# EAGLE design DMClock2018 (EAGLE 5.12)
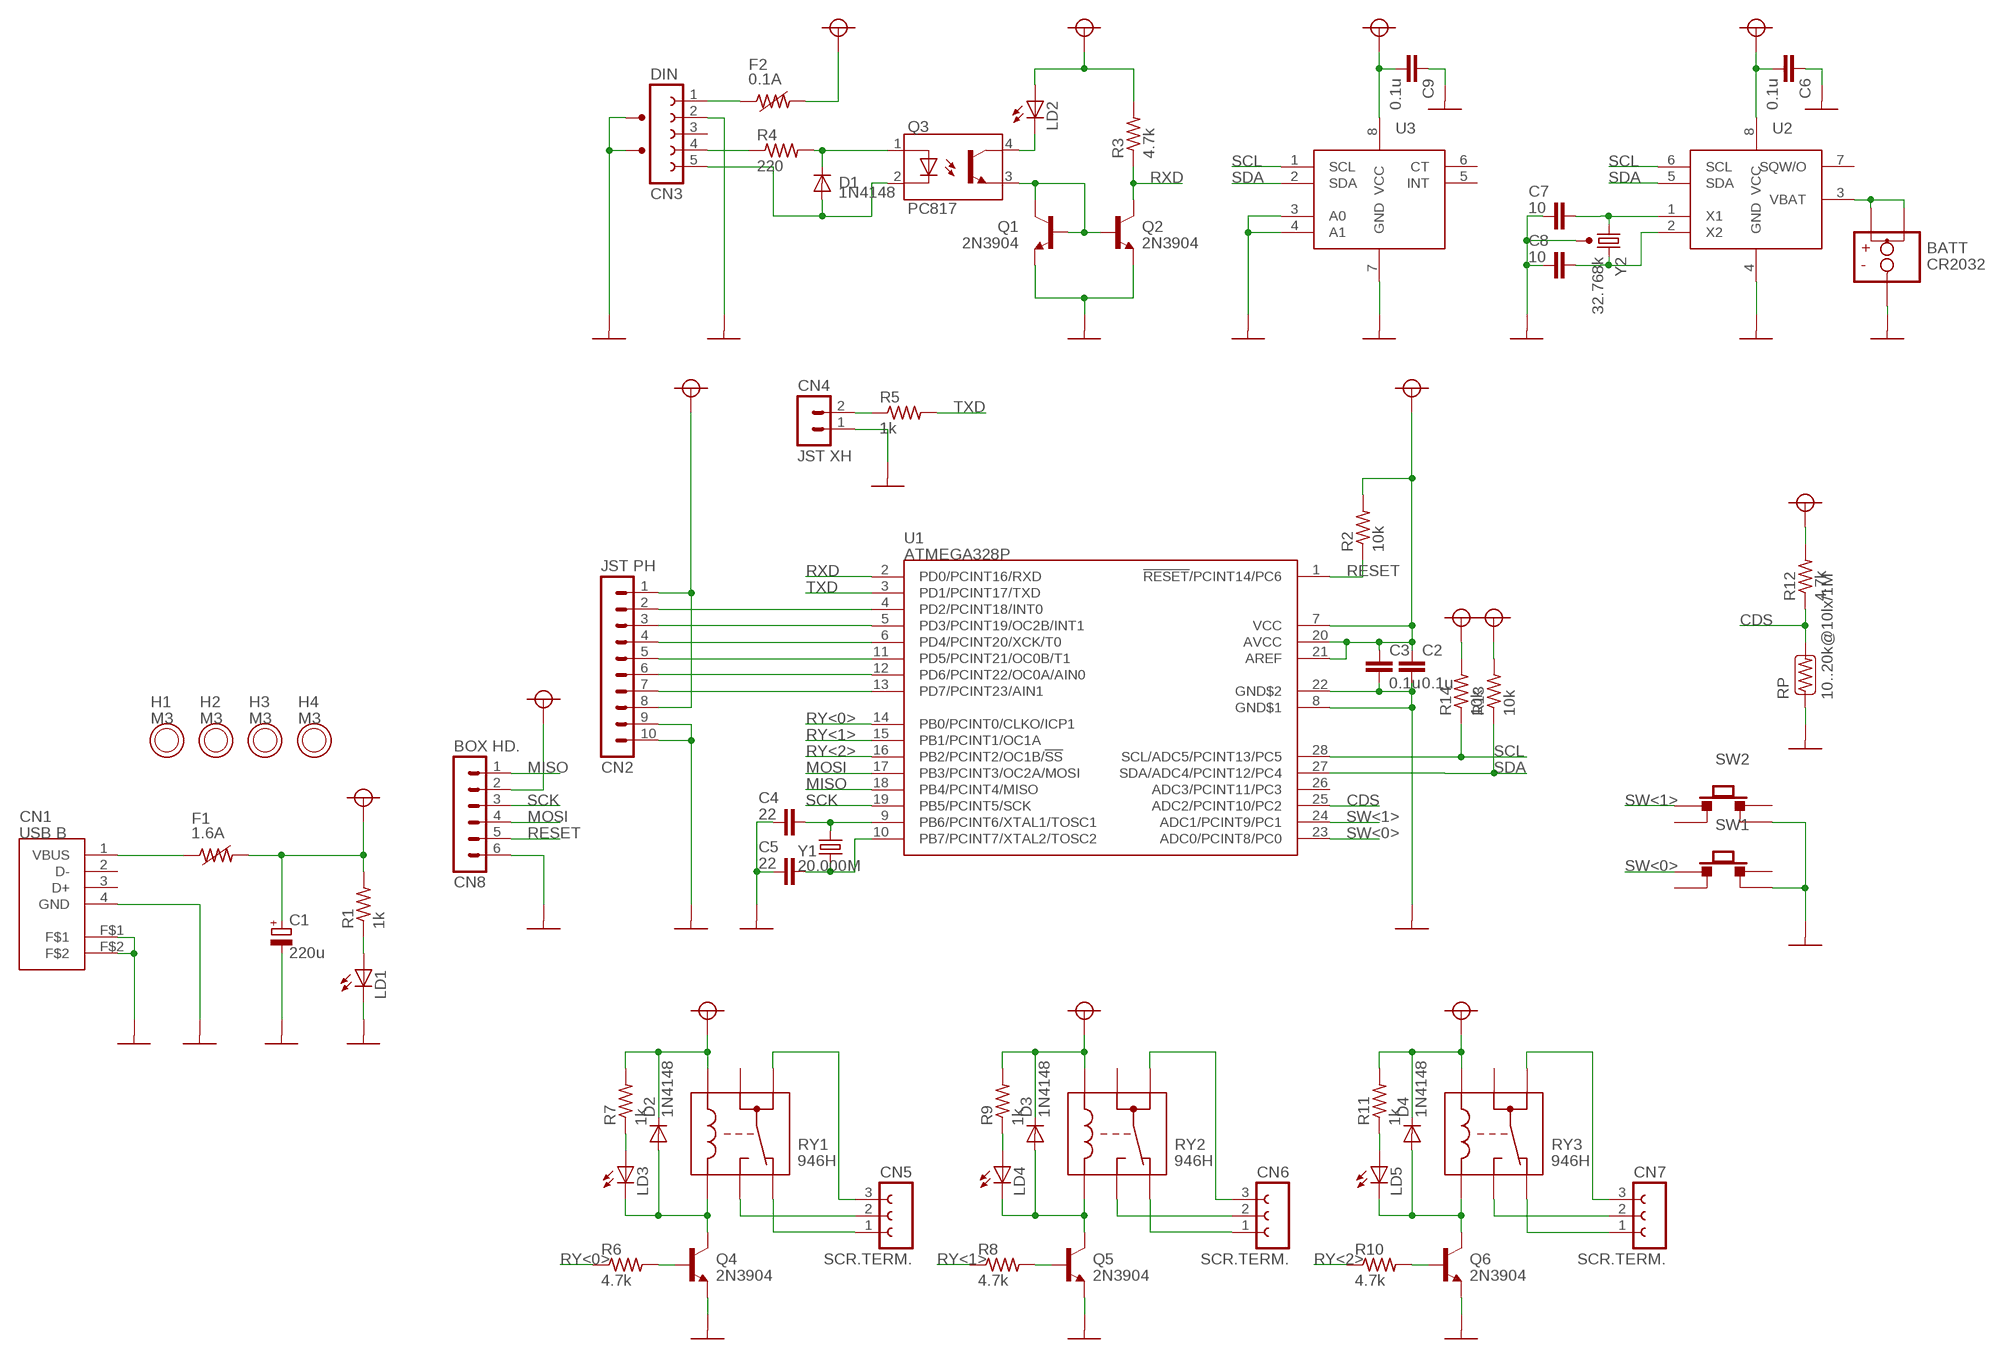
[diagram p0: schematic, sheet 1]

## Parts
BATT  CR2032  BATT_2+'CH005-2032'  [CH005-2032]
C1  220u  CPOL'8MM_3MM5'  [CPOL_8MM_3MM5]
C2  0.1u  C'100MIL'  [C_100MIL]
C3  0.1u  C'100MIL'  [C_100MIL]
C4  22  C'100MIL'  [C_100MIL]
C5  22  C'100MIL'  [C_100MIL]
C6  0.1u  C'100MIL'  [C_100MIL]
C7  10  C'100MIL'  [C_100MIL]
C8  10  C'100MIL'  [C_100MIL]
C9  0.1u  C'100MIL'  [C_100MIL]
CN1  USB B  USBB_F2'5075BR-04'  [5075BR-04]
CN2  JST PH  MA10'PH'  [PH10]
CN3  DIN  DIN05_F2'KDJ03'  [KDJ03-5]
CN4  JST XH  MA02'XH'  [XH02]
CN5  SCR.TERM.  SCRTERM03'TB112'  [TB112_03]
CN6  SCR.TERM.  SCRTERM03'TB112'  [TB112_03]
CN7  SCR.TERM.  SCRTERM03'TB112'  [TB112_03]
CN8  BOX HD.  MA06-2'BOX'  [MA06-2_BOX]
D1  1N4148  D'200MIL'  [D_200MIL]
D2  1N4148  D'200MIL'  [D_200MIL]
D3  1N4148  D'200MIL'  [D_200MIL]
D4  1N4148  D'200MIL'  [D_200MIL]
F1  1.6A  PF'7MM4X3MM'  [PF_7MM4X3MM]
F2  0.1A  PF'7MM4X3MM'  [PF_7MM4X3MM]
H1  M3  H'M3'  [H_M3]
H2  M3  H'M3'  [H_M3]
H3  M3  H'M3'  [H_M3]
H4  M3  H'M3'  [H_M3]
LD1  LD'3MM'  [LD_3MM]
LD2  LD'3MM'  [LD_3MM]
LD3  LD'3MM'  [LD_3MM]
LD4  LD'3MM'  [LD_3MM]
LD5  LD'3MM'  [LD_3MM]
Q1  2N3904  NPN'TO92_EBC'  [TO92]
Q2  2N3904  NPN'TO92_EBC'  [TO92]
Q3  PC817  PHI'DIL04_AKEC'  [DIL04]
Q4  2N3904  NPN'TO92_EBC'  [TO92]
Q5  2N3904  NPN'TO92_EBC'  [TO92]
Q6  2N3904  NPN'TO92_EBC'  [TO92]
R1  1k  R'300MIL'  [R_300MIL]
R2  10k  R'300MIL'  [R_300MIL]
R3  4.7k  R'300MIL'  [R_300MIL]
R4  220  R'300MIL'  [R_300MIL]
R5  1k  R'300MIL'  [R_300MIL]
R6  4.7k  R'300MIL'  [R_300MIL]
R7  1k  R'300MIL'  [R_300MIL]
R8  4.7k  R'300MIL'  [R_300MIL]
R9  1k  R'300MIL'  [R_300MIL]
R10  4.7k  R'300MIL'  [R_300MIL]
R11  1k  R'300MIL'  [R_300MIL]
R12  4.7k  R'300MIL'  [R_300MIL]
R13  10k  R'300MIL'  [R_300MIL]
R14  10k  R'300MIL'  [R_300MIL]
RP  10..20k@10lx/1M  RP'MI5'  [RP_MI5]
RY1  946H  RY_1CC'946H'  [946H_1C]
RY2  946H  RY_1CC'946H'  [946H_1C]
RY3  946H  RY_1CC'946H'  [946H_1C]
SW1  PUSHSW_1PP1TT'*'  [PUSHSW_*]
SW2  PUSHSW_1PP1TT'*'  [PUSHSW_*]
U1  ATMEGA328P  ATMEGA8_DIL  [DIL28]
U2  DS1307'DIL'  [DIL08]
U3  ADT7410'SO'  [SO08]
Y1  20.000M  Y'HC49'  [HC49]
Y2  32.768k  Y_FRAME'VT200'  [VT200]

## Nets
+5V0: C1.+ C2.1 C3.1 C6.2 C9.2 CN2.1 CN2.8 CN8.2 D2.K D3.K D4.K F1.2 F2.2 LD2.A R1.2 R2.2 R3.2 R7.2 R9.2 R11.2 R12.2 R13.2 R14.2 RY1.COIL$2 RY2.COIL$2 RY3.COIL$2 U1.7(VCC) U1.20(AVCC) U1.21(AREF) U2.8(VCC) U3.8(VCC) ; supply symbol labelled V+
CDS: R12.1 RP.2 U1.25(ADC2/PCINT10/PC2)
GND: BATT.- C1.- C2.2 C3.2 C4.1 C5.1 C6.1 C7.1 C8.1 C9.1 CN1.4(GND) CN1.F$1 CN1.F$2 CN2.9 CN2.10 CN3.2 CN3.F1 CN3.F2 CN4.1 CN8.6 LD1.K Q1.1(E) Q2.1(E) Q4.1(E) Q5.1(E) Q6.1(E) RP.1 SW1.P1$2 SW2.P1$2 U1.8(GND$1) U1.22(GND$2) U2.4(GND) U3.3(A0) U3.4(A1) U3.7(GND) Y2.F
MISO: CN8.1 U1.18(PB4/PCINT4/MISO)
MOSI: CN8.4 U1.17(PB3/PCINT3/OC2A/MOSI)
N$1: CN2.2 U1.4(PD2/PCINT18/INT0)
N$2: CN1.1(VBUS) F1.1
N$3: LD1.A R1.1
N$4: CN2.3 U1.5(PD3/PCINT19/OC2B/INT1)
N$5: CN2.4 U1.6(PD4/PCINT20/XCK/T0)
N$6: CN2.5 U1.11(PD5/PCINT21/OC0B/T1)
N$7: CN2.6 U1.12(PD6/PCINT22/OC0A/AIN0)
N$8: CN2.7 U1.13(PD7/PCINT23/AIN1)
N$9: CN3.4 R4.1
N$10: LD2.K Q3.4(C)
N$11: Q1.2(B) Q1.3(C) Q2.2(B) Q3.3(E)
N$12: D1.K Q3.1(A) R4.2
N$13: CN4.2 R5.1
N$14: BATT.+$1 BATT.+$2 U2.3(VBAT)
N$15: C5.2 U1.10(PB7/PCINT7/XTAL2/TOSC2) Y1.1
N$16: C4.2 U1.9(PB6/PCINT6/XTAL1/TOSC1) Y1.2
N$17: Q4.2(B) R6.2
N$18: CN3.1 F2.1
N$19: CN3.5 D1.A Q3.2(K)
N$21: D2.A LD3.K Q4.3(C) RY1.COIL$1
N$23: LD3.A R7.1
N$24: CN5.3 RY1.COM$2
N$25: CN5.2 RY1.NO
N$26: CN5.1 RY1.NC
N$27: Q5.2(B) R8.2
N$28: D3.A LD4.K Q5.3(C) RY2.COIL$1
N$29: LD4.A R9.1
N$30: CN6.3 RY2.COM$2
N$31: CN6.2 RY2.NO
N$32: CN6.1 RY2.NC
N$34: Q6.2(B) R10.2
N$35: D4.A LD5.K Q6.3(C) RY3.COIL$1
N$36: LD5.A R11.1
N$37: CN7.3 RY3.COM$2
N$38: CN7.2 RY3.NO
N$39: CN7.1 RY3.NC
N$41: C7.2 U2.1(X1) Y2.1
N$42: C8.2 U2.2(X2) Y2.2
RESET: CN8.5 R2.1 U1.1(!RESET!/PCINT14/PC6)
RXD: Q2.3(C) R3.1 U1.2(PD0/PCINT16/RXD)
RY<0>: R6.1 U1.14(PB0/PCINT0/CLKO/ICP1)
RY<1>: R8.1 U1.15(PB1/PCINT1/OC1A)
RY<2>: R10.1 U1.16(PB2/PCINT2/OC1B/!SS!)
SCK: CN8.3 U1.19(PB5/PCINT5/SCK)
SCL: R14.1 U1.28(SCL/ADC5/PCINT13/PC5) U2.6(SCL) U3.1(SCL)
SDA: R13.1 U1.27(SDA/ADC4/PCINT12/PC4) U2.5(SDA) U3.2(SDA)
SW<0>: SW1.P2$1 U1.23(ADC0/PCINT8/PC0)
SW<1>: SW2.P2$1 U1.24(ADC1/PCINT9/PC1)
TXD: R5.2 U1.3(PD1/PCINT17/TXD)
Unconnected: CN1.2(D-) CN1.3(D+) CN3.3 RY1.COM$1 RY2.COM$1 RY3.COM$1 SW1.P1$1 SW1.P2$2 SW2.P1$1 SW2.P2$2 U1.26(ADC3/PCINT11/PC3) U2.7(SQW/O) U3.5(INT) U3.6(CT)

## Library data of the parts
BATT = DMClock2018:BATT_2+: Battery connector, with 2 positive pads
C1 = DMClock2018:CPOL: Capacitor, polarized
C2-C9 = DMClock2018:C: Capacitor, non-polarized
CN1 = DMClock2018:USBB_F2: USB type B connector, with 2 frame poles
CN2 = DMClock2018:MA10: Male header, 10 poles
CN3 = DMClock2018:DIN05_F2: DIN connector, 5 poles, with 2 frame poles
CN4 = DMClock2018:MA02: Male header, 2 poles
CN5-CN7 = DMClock2018:SCRTERM03: Screw terminal, 3 poles
CN8 = DMClock2018:MA06-2: Male header, 6 poles
D1-D4 = DMClock2018:D: Diode
F1 F2 = DMClock2018:PF: Polyfuse
H1-H4 = DMClock2018:H: Unmasked PCB hole
LD1-LD5 = DMClock2018:LD: Light-emitting diode
Q1 Q2 Q4-Q6 = DMClock2018:NPN: NPN bipolar junction transistor
Q3 = DMClock2018:PHI: Photo isolator, transitor output
R1-R14 = DMClock2018:R: Resistor
RP = DMClock2018:RP: Photo resistor
RY1-RY3 = DMClock2018:RY_1CC: Magnetic relay, type 1C with two common contacts
SW1 SW2 = DMClock2018:PUSHSW_1PP1TT: Push switch, 1 pole, 1 throw, with 2 pads each
U1 = DMClock2018:ATMEGA8_DIL: Atmel ATmega__8 AVR 8-bit microcontroller (DIL package)
U2 = DMClock2018:DS1307: Maxim DS1307 real time clock
U3 = DMClock2018:ADT7410: Analog Devices I2C temperature sensor
Y1 = DMClock2018:Y: Crystal oscillator
Y2 = DMClock2018:Y_FRAME: Crystal oscillator, with a frame pad

## Board
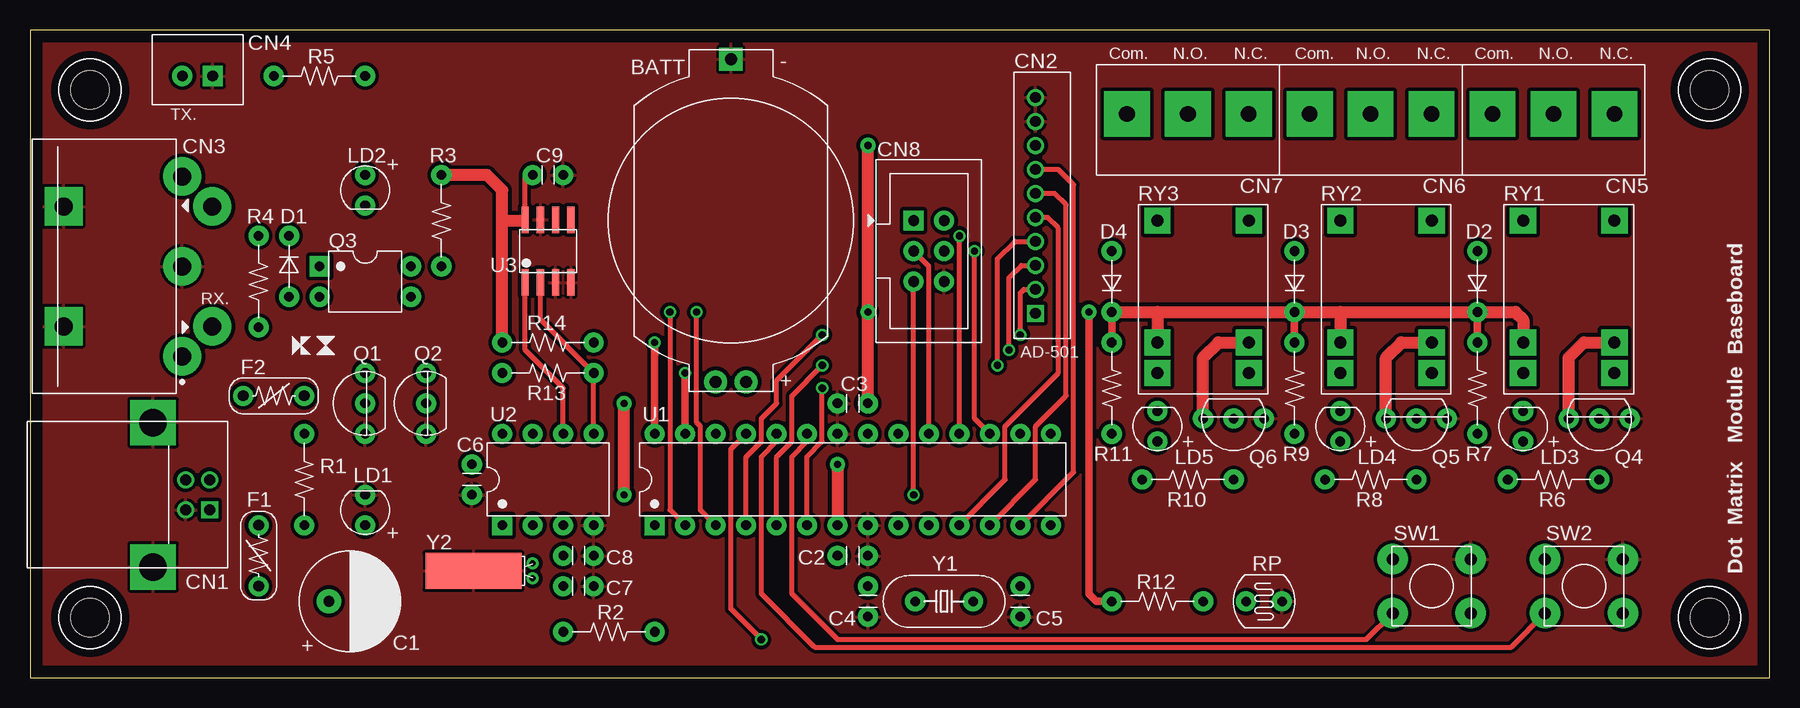
[diagram p1: board, top side]
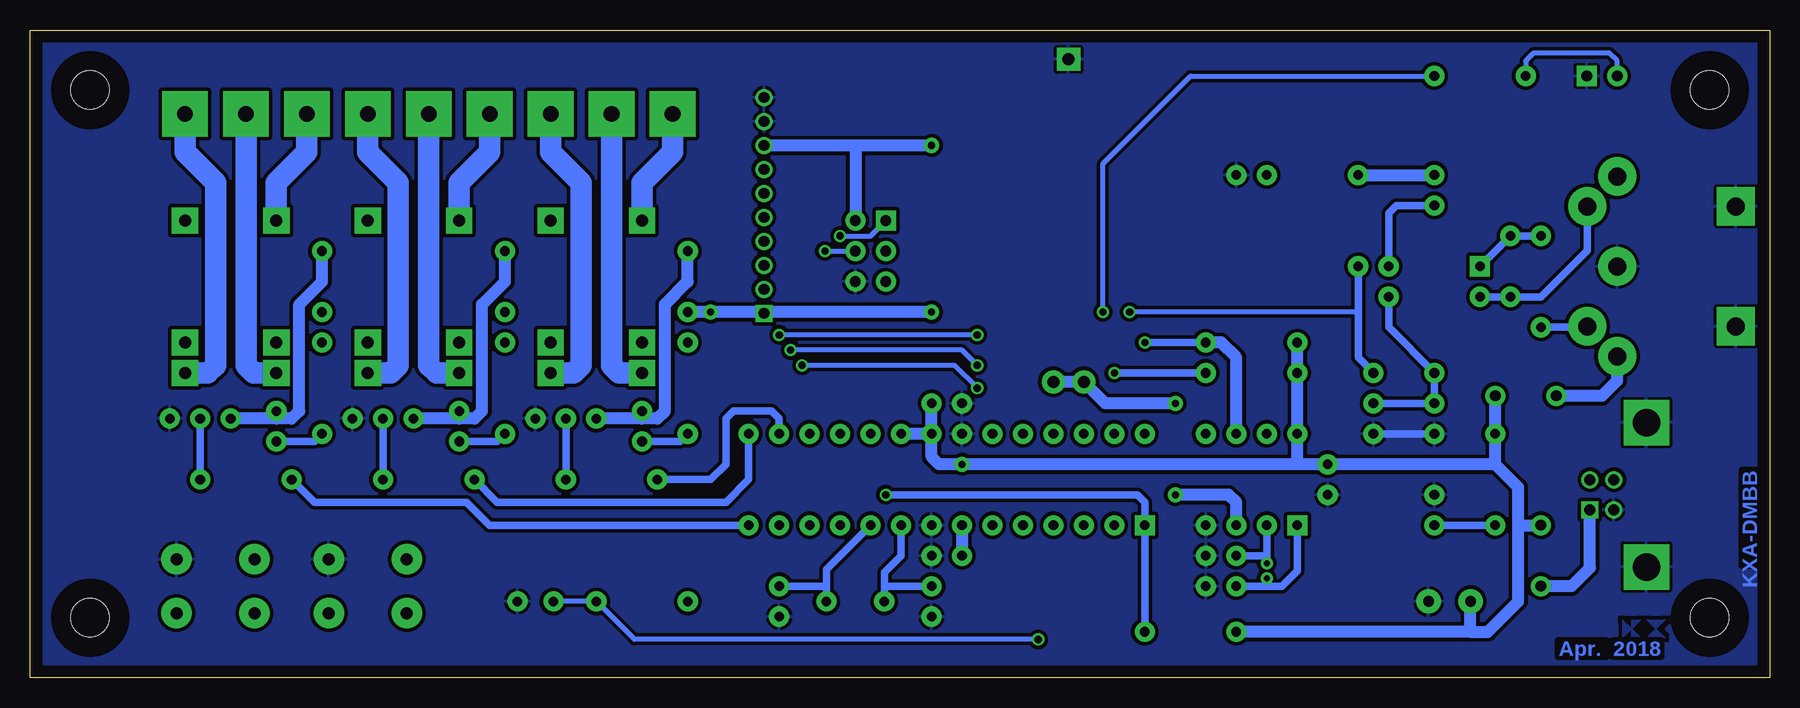
[diagram p2: board, bottom side, seen from below]

Size 145 x 54 mm. Coordinates in mm from the lower left corner, seen from the top.
Outline: 0,0 145,0 145,54 0,54 0,0
Copper layers (1*16): Top 0.035mm / dielectric 1.5mm / Bottom 0.035mm
Design rules "default *": minimum track width 10mil, minimum drill 24mil, track to track 12mil, track to pad 12mil, pad to pad 12mil, via to via 12mil, smd to smd 12mil, copper to edge 40mil, drill to drill 8mil, minimum pad ring 10mil, minimum via ring 8mil, stop-mask expansion 4mil, vias tented up to drill 0mil, thermal gap 10mil

### Footprints (pad centres in the part's own frame; a part is rotated, then mirrored left to right if it is on the bottom)
CH005-2032 = drill 1 pad 1.93 round: +$1 -13.45,-1.27; +$2 -13.45,1.27 | drill 1 pad 1.93 square: - 13.45,0
CPOL_8MM_3MM5 = drill 0.9 pad 2.032 round: + -1.75,0; - 1.75,0
C_100MIL = drill 0.8 pad 1.676 round: 1 -1.27,0; 2 1.27,0
5075BR-04 = drill 0.9 pad 1.422 square: 1 -1.25,-1 | drill 0.9 pad 1.422 round: 2 1.25,-1; 3 1.25,1; 4 -1.25,1 | drill 2.3 pad 3.81 square: F$1 -6.02,3.71; F$2 6.02,3.71
PH10 = drill 0.9 pad 1.422 square: 1 -9,0 | drill 0.9 pad 1.422 round: 2 -7,0; 3 -5,0; 4 -3,0; 5 -1,0; 6 1,0; 7 3,0; 8 5,0; 9 7,0; 10 9,0
KDJ03-5 = drill 1.5 pad 3.175 round: 1 -7.5,0; 2 0,0; 3 7.5,0; 4 -5,-2.5; 5 5,-2.5 | drill 1.5 pad 3.175 square: F1 -5,9.9; F2 5,9.9
XH02 = drill 0.9 pad 1.676 square: 1 -1.27,0 | drill 0.9 pad 1.676 round: 2 1.27,0
TB112_03 = drill 1.3 pad 3.81 square: 1 -5.08,0; 2 0,0; 3 5.08,0
MA06-2_BOX = drill 0.9 pad 1.676 square: 1 -1.27,2.54 | drill 0.9 pad 1.676 round: 2 1.27,2.54; 3 -1.27,0; 4 1.27,0; 5 -1.27,-2.54; 6 1.27,-2.54
D_200MIL = drill 0.8 pad 1.676 round: A -2.54,0; K 2.54,0
PF_7MM4X3MM = drill 0.9 pad 1.676 round: 1 -2.54,0; 2 2.54,0
H_M3 = hole 3.2: 0,0
LD_3MM = drill 0.8 pad 1.676 round: A -1.27,0; K 1.27,0
TO92 = drill 0.8 pad 1.676 round: 1 -2.54,0; 2 0,0; 3 2.54,0
DIL04 = drill 0.8 pad 1.676 square: 1 -1.27,-3.81 | drill 0.8 pad 1.676 round: 2 1.27,-3.81; 3 1.27,3.81; 4 -1.27,3.81
R_300MIL = drill 0.8 pad 1.676 round: 1 -3.81,0; 2 3.81,0
RP_MI5 = drill 0.8 pad 1.676 round: 1 -1.5,0; 2 1.5,0
946H_1C = drill 1 pad 2.184 square: COIL$1 -3.81,-3.81; COIL$2 -3.81,3.81; COM$1 6.35,-3.81; COM$2 6.35,3.81; NC -6.35,-3.81; NO -6.35,3.81
PUSHSW_* = drill 1 pad 2.54 round: P1$1 -2.25,-3.25; P1$2 -2.25,3.25; P2$1 2.25,-3.25; P2$2 2.25,3.25
DIL28 = drill 0.8 pad 1.676 square: 1 -16.51,-3.81 | drill 0.8 pad 1.676 round: 2 -13.97,-3.81; 3 -11.43,-3.81; 4 -8.89,-3.81; 5 -6.35,-3.81; 6 -3.81,-3.81; 7 -1.27,-3.81; 8 1.27,-3.81; 9 3.81,-3.81; 10 6.35,-3.81; 11 8.89,-3.81; 12 11.43,-3.81; 13 13.97,-3.81; 14 16.51,-3.81; 15 16.51,3.81; 16 13.97,3.81; 17 11.43,3.81; 18 8.89,3.81; 19 6.35,3.81; 20 3.81,3.81; 21 1.27,3.81; 22 -1.27,3.81; 23 -3.81,3.81; 24 -6.35,3.81; 25 -8.89,3.81; 26 -11.43,3.81; 27 -13.97,3.81; 28 -16.51,3.81
DIL08 = drill 0.8 pad 1.676 square: 1 -3.81,-3.81 | drill 0.8 pad 1.676 round: 2 -1.27,-3.81; 3 1.27,-3.81; 4 3.81,-3.81; 5 3.81,3.81; 6 1.27,3.81; 7 -1.27,3.81; 8 -3.81,3.81
SO08 = smd 0.61 x 2.21: 1 -1.905,-2.616; 2 -0.635,-2.616; 3 0.635,-2.616; 4 1.905,-2.616; 5 1.905,2.616; 6 0.635,2.616; 7 -0.635,2.616; 8 -1.905,2.616
HC49 = drill 0.8 pad 1.676 round: 1 -2.413,0; 2 2.413,0
VT200 = drill 0.5 pad 0.813 round: 1 0,-0.635; 2 0,0.635 | smd 8 x 3: F -4.945,0

### Placement (x,y rotation side)
BATT  58.42,38.1 90 top
C1  26.67,6.35 0 top
C2  68.58,10.16 0 top
C3  68.58,22.86 180 top
C4  69.85,6.35 90 top
C5  82.55,6.35 90 top
C6  36.83,16.51 90 top
C7  45.72,7.62 180 top
C8  45.72,10.16 180 top
C9  43.18,41.91 180 top
CN1  13.97,15.24 90 top
CN2  83.82,39.37 90 top
CN3  12.7,34.29 90 top
CN4  13.97,50.16 180 top
CN5  127,46.99 180 top
CN6  111.76,46.99 180 top
CN7  96.52,46.99 180 top
CN8  74.93,35.56 0 top
D1  21.59,34.29 90 top
D2  120.65,33.02 270 top
D3  105.41,33.02 270 top
D4  90.17,33.02 270 top
F1  19.05,10.16 90 top
F2  20.32,23.5 0 top
H1  5,5 0 top
H2  5,49 0 top
H3  140,5 0 top
H4  140,49 0 top
LD1  27.94,13.97 90 top
LD2  27.94,40.64 270 top
LD3  124.46,20.95 90 top
LD4  109.22,20.95 90 top
LD5  93.98,20.95 90 top
Q1  27.94,22.86 90 top
Q2  33.02,22.86 90 top
Q3  27.94,33.02 270 top
Q4  130.81,21.59 180 top
Q5  115.57,21.59 180 top
Q6  100.33,21.59 180 top
R1  22.86,16.51 90 top
R2  48.26,3.81 180 top
R3  34.29,38.1 90 top
R4  19.05,33.02 90 top
R5  24.13,50.16 0 top
R6  127,16.51 0 top
R7  120.65,24.13 90 top
R8  111.76,16.51 0 top
R9  105.41,24.13 90 top
R10  96.52,16.51 0 top
R11  90.17,24.13 90 top
R12  93.98,6.35 180 top
R13  43.18,25.4 180 top
R14  43.18,27.94 180 top
RP  102.87,6.35 180 top
RY1  128.27,31.75 90 top
RY2  113.03,31.75 90 top
RY3  97.79,31.75 90 top
SW1  116.84,7.62 270 top
SW2  129.54,7.62 270 top
U1  68.58,16.51 0 top
U2  43.18,16.51 0 top
U3  43.18,35.56 0 top
Y1  76.2,6.35 180 top
Y2  41.91,8.89 0 top

### Tracks (layer width: path | path; a pad name or v marks a point on that pad's centre or on a via)
+5V0  (via drill 0.6 pad 1.27)
  Top 0.406: C9.2 41.27,41.91 U3.8 41.27,38.1 40.96,38.1
  Top 0.61: D4.K R11.2 | D2.K R7.2 | D3.K R9.2 | R12.2 88.9,6.35 88.27,6.99 v88.27,30.48
  Top 1.016: 93.98,30.48 D3.K 109.22,30.48 | D4.K 93.98,30.48 | 109.22,30.48 D2.K 123.83,30.48 124.46,29.84 RY1.COIL$2 | 109.22,30.48 RY2.COIL$2 | 93.98,30.48 RY3.COIL$2 | v67.31,17.78 U1.7 | 39.37,38.1 40.96,38.1 | R14.2 39.37,38.1 | 39.37,38.1 39.37,40.64 38.1,41.91 R3.2 | C3.1 v69.85,30.48 v69.85,44.37
  Bottom 1.016: R3.2 LD2.A | F2.2 R1.2 22.86,17.78 | U1.7 C2.1 | U1.21 U1.20 | U1.21 C3.1 | 39.37,17.78 C6.2 22.86,17.78 | 39.37,17.78 U2.8 R13.2 R14.2 | 39.37,17.78 v67.31,17.78 69.22,17.78 69.85,18.41 U1.21 | D4.K v88.27,30.48 83.93,30.48 CN2.1 83.82,30.48 v69.85,30.48 | 22.86,17.78 20.95,15.88 20.95,12.7 | 20.95,12.7 20.95,6.35 23.5,3.81 24.92,3.81 | 20.95,12.7 F1.2 | 24.92,3.81 C1.+ | 24.92,3.81 R2.2 | 76.2,44.37 CN2.8 | v69.85,44.37 76.2,44.37 | 76.2,44.37 CN8.2
CDS  (via drill 0.6 pad 0.61)
  Top 0.406: v60.96,3.17 58.42,5.71 58.42,19.05 U1.25
  Bottom 0.406: v60.96,3.17 94.61,3.17 R12.1 RP.2
GND
  Bottom 0.61: Q1.1 Q2.1
  pour Bottom (rank 2): 1,53 144,53 144,1 1,1
  pour Top: 1,53 144,53 144,1 1,1
MISO  (via drill 0.6 pad 0.61)
  Top 0.406: U1.18 v77.47,36.83
  Bottom 0.406: CN8.1 74.93,36.83 v77.47,36.83
MOSI  (via drill 0.6 pad 0.61)
  Top 0.406: U1.17 78.74,21.59 v78.74,35.56
  Bottom 0.406: v78.74,35.56 CN8.4
N$1  (via drill 0.6 pad 0.61)
  Top 0.406: U1.4 59.69,18.41 60.96,19.68 60.96,21.59 62.23,22.86 62.23,24.77 v66.04,28.57 | v82.55,28.57 82.55,32.07 82.85,32.37 CN2.2
  Bottom 0.406: v66.04,28.57 v82.55,28.57
N$2
  Bottom 1.016: CN1.1 14.97,9.16 16.51,7.62 F1.1
N$3
  Bottom 0.61: R1.1 LD1.A
N$4  (via drill 0.6 pad 0.61)
  Top 0.406: U1.5 62.23,18.41 63.5,19.68 63.5,23.5 v66.04,26.04 | v81.6,27.3 81.6,33.34 82.63,34.37 CN2.3
  Bottom 0.406: v66.04,26.04 67.31,27.3 v81.6,27.3
N$5  (via drill 0.6 pad 0.61)
  Top 0.406: v66.04,24.13 66.04,19.68 64.77,18.41 U1.6 | v80.64,26.04 80.64,34.92 82.09,36.37 CN2.4
  Bottom 0.406: v66.04,24.13 67.94,26.04 v80.64,26.04
N$6
  Top 0.406: U1.11 81.28,16.51 81.28,20.95 85.72,25.4 85.72,37.47 84.82,38.37 CN2.5
N$7
  Top 0.406: U1.12 83.82,16.51 83.82,20.95 86.36,23.5 86.36,39.42 85.41,40.37 CN2.6
N$8
  Top 0.406: U1.13 87,17.14 87,41.1 85.72,42.37 CN2.7
N$9
  Bottom 0.61: R4.1 15.28,29.21 CN3.4
N$10
  Bottom 0.61: LD2.K 31.11,39.37 31.75,38.73 Q3.4
N$11
  Bottom 0.61: Q2.2 Q1.2 Q1.3 31.75,29.21 Q3.3
N$12
  Bottom 0.61: R4.2 D1.K Q3.1
N$13
  Bottom 0.406: CN4.2 12.7,51.44 13.34,52.07 19.68,52.07 20.32,51.44 R5.1
N$14  (via drill 0.6 pad 1.27)
  Top 1.016: v49.53,15.24 v49.53,22.86
  Bottom 1.016: BATT.+$1 BATT.+$2 55.36,22.86 v49.53,22.86 | v49.53,15.24 45.09,15.24 44.45,14.61 U2.3
N$15
  Bottom 0.61: U1.10 78.61,9.02 Y1.1 78.61,7.62 C5.2
N$16
  Bottom 0.61: 73.79,7.62 Y1.2 | 73.79,7.62 73.79,8.76 72.39,10.16 U1.9 | C4.2 73.79,7.62
N$17
  Bottom 0.61: R6.2 Q4.2
N$18
  Bottom 1.016: F2.1 13.97,23.5 12.7,24.77 CN3.1
N$19
  Bottom 0.61: Q3.2 D1.A 19.05,31.75 15.2,35.6 CN3.5
N$20
  pour Bottom: 8.7,4.83 9.46,4.06 10.22,4.83
N$21
  Top 1.016: Q4.3 128.27,26.67 129.54,27.94 RY1.COIL$1
  Bottom 1.016: D2.A 120.65,33.02 122.56,31.11 122.56,22.23 123.19,21.59 124.46,21.59 | 124.46,21.59 Q4.3 | 124.46,21.59 LD3.K
N$22
  pour Bottom: 9.46,4.06 10.22,3.3 8.7,3.3
N$23
  Bottom 0.61: R7.1 121.28,19.68 LD3.A
N$24
  Bottom 1.778: RY1.COM$2 124.46,41.27 121.92,43.81 CN5.3
N$25
  Bottom 1.778: RY1.NO 126.36,25.4 127,26.04 CN5.2
N$26
  Bottom 1.778: RY1.NC 130.18,25.4 129.54,26.04 129.54,41.27 132.08,43.81 CN5.1
N$27
  Bottom 0.61: R8.2 Q5.2
N$28
  Top 1.016: Q5.3 113.03,26.67 114.3,27.94 RY2.COIL$1
  Bottom 1.016: D3.A 105.41,33.02 107.31,31.11 107.31,22.23 107.95,21.59 109.22,21.59 | 109.22,21.59 Q5.3 | 109.22,21.59 LD4.K
N$29
  Bottom 0.61: R9.1 106.05,19.68 LD4.A
N$30
  Bottom 1.778: RY2.COM$2 109.22,41.27 106.68,43.81 CN6.3
N$31
  Bottom 1.778: RY2.NO 111.12,25.4 111.76,26.04 CN6.2
N$32
  Bottom 1.778: RY2.NC 114.94,25.4 114.3,26.04 114.3,41.27 116.84,43.81 CN6.1
N$33
  pour Bottom: 10.73,4.83 11.49,4.06 11.49,4.83
N$34
  Bottom 0.61: R10.2 Q6.2
N$35
  Top 1.016: Q6.3 97.79,26.67 99.06,27.94 RY3.COIL$1
  Bottom 1.016: D4.A 90.17,33.02 92.08,31.11 92.08,22.23 92.71,21.59 93.98,21.59 | 93.98,21.59 Q6.3 | 93.98,21.59 LD5.K
N$36
  Bottom 0.61: R11.1 90.81,19.68 LD5.A
N$37
  Bottom 1.778: RY3.COM$2 93.98,41.27 91.44,43.81 CN7.3
N$38
  Bottom 1.778: CN7.2 96.52,26.04 95.89,25.4 RY3.NO
N$39
  Bottom 1.778: RY3.NC 99.69,25.4 99.06,26.04 99.06,41.27 101.6,43.81 CN7.1
N$40
  pour Bottom: 11.49,4.06 10.73,3.3 11.49,3.3
N$41
  Bottom 0.61: U2.1 39.37,8.89 40.64,7.62 41.91,7.62 | 41.91,7.62 C7.2 | 41.91,7.62 Y2.1
N$42
  Bottom 0.61: C8.2 41.91,10.16 Y2.2 U2.2
N$43
  pour Bottom: 11.49,4.06 12.26,4.83 12.26,3.3
RESET  (via drill 0.6 pad 0.61)
  Top 0.406: v73.66,15.24 CN8.5
  Bottom 0.61: v73.66,15.24 52.7,15.24 52.07,14.61 U1.1 R2.1
RXD  (via drill 0.6 pad 0.61)
  Top 0.406: U1.2 53.34,13.97 v53.34,30.48
  Bottom 0.406: 34.29,30.48 v53.34,30.48
  Bottom 0.61: Q2.3 34.29,26.67 34.29,30.48 R3.1
RY<0>
  Bottom 0.61: U1.14 106.68,12.7 108.58,14.61 121.28,14.61 R6.1
RY<1>
  Bottom 0.61: U1.15 85.09,16.51 87,14.61 106.05,14.61 R8.1
RY<2>
  Bottom 0.61: U1.16 82.55,21.59 83.19,22.23 86.36,22.23 87,21.59 87,17.78 88.27,16.51 R10.1
SCK
  Top 0.406: CN8.3 74.93,34.29 U1.19
SCL  (via drill 0.6 pad 0.81)
  Top 0.406: U3.1 41.27,27.3 44.45,24.13 U2.6
  Top 0.61: v52.07,27.94 U1.28
  Bottom 0.61: R14.1 v52.07,27.94
  Bottom 1.016: R14.1 45.72,27.94 44.45,26.67 U2.6
SDA  (via drill 0.6 pad 0.81)
  Top 0.406: U3.2 42.55,29.84 R13.1 U2.5
  Top 0.61: v54.61,25.4 U1.27
  Bottom 0.61: R13.1 v54.61,25.4
SW<0>
  Top 0.406: U1.23 64.77,19.68 63.5,18.41 63.5,6.99 67.31,3.17 111.39,3.17 SW1.P2$1
SW<1>
  Top 0.406: U1.24 62.23,19.68 60.96,18.41 60.96,6.99 65.41,2.54 123.46,2.54 SW2.P2$1
TXD  (via drill 0.6 pad 0.61)
  Top 0.406: v55.56,30.48 55.56,21.27 55.88,20.95 55.88,13.97 U1.3
  Bottom 0.406: R5.2 48.26,50.16 55.56,42.86 v55.56,30.48

### Text on the board
Bottom: KXA-DMBB | 2018 | Apr.
tNames: Com. | N.O. | N.C. | Com. | N.O. | N.C. | Com. | N.O. | N.C. | - | TX. | + | RX. | AD-501 | Baseboard | + | Module | + | + | + | Matrix | + | Dot | +